# Altium project betrusted-kbd-interposer.PrjPcb
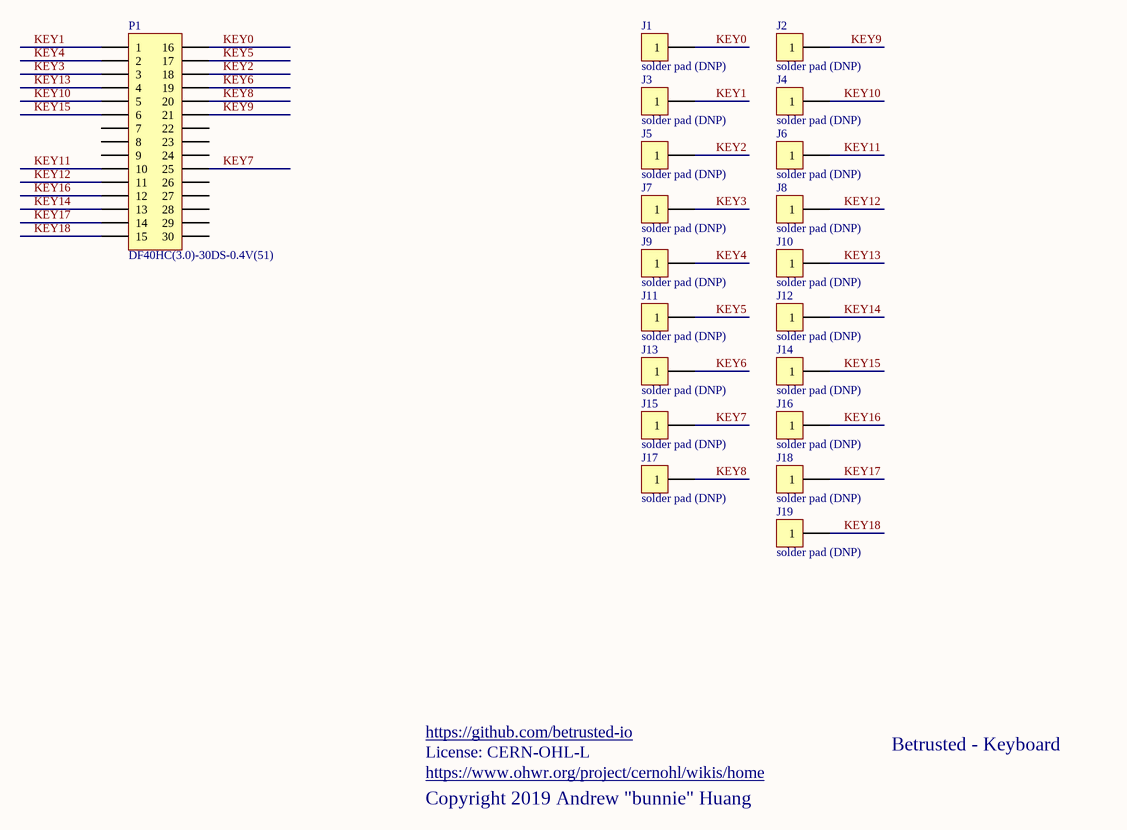
[diagram p0: interposer.SchDoc]
1 sheet, 20 parts. Net scope: global (net labels, ports and power ports of the same name join across sheets).
Board file: bt-kbd-interposer.PcbDoc

## Sheet interposer.SchDoc
size B

### Parts
J1  solder pad (DNP)  [TP_TH1.0mm_1.5x2mm_SQ]
J2  solder pad (DNP)  [TP_TH1.0mm_1.5x2mm_SQ]
J3  solder pad (DNP)  [TP_TH1.0mm_1.5x2mm_SQ]
J4  solder pad (DNP)  [TP_TH1.0mm_1.5x2mm_SQ]
J5  solder pad (DNP)  [TP_TH1.0mm_1.5x2mm_SQ]
J6  solder pad (DNP)  [TP_TH1.0mm_1.5x2mm_SQ]
J7  solder pad (DNP)  [TP_TH1.0mm_1.5x2mm_SQ]
J8  solder pad (DNP)  [TP_TH1.0mm_1.5x2mm_SQ]
J9  solder pad (DNP)  [TP_TH1.0mm_1.5x2mm_SQ]
J10  solder pad (DNP)  [TP_TH1.0mm_1.5x2mm_SQ]
J11  solder pad (DNP)  [TP_TH1.0mm_1.5x2mm_SQ]
J12  solder pad (DNP)  [TP_TH1.0mm_1.5x2mm_SQ]
J13  solder pad (DNP)  [TP_TH1.0mm_1.5x2mm_SQ]
J14  solder pad (DNP)  [TP_TH1.0mm_1.5x2mm_SQ]
J15  solder pad (DNP)  [TP_TH1.0mm_1.5x2mm_SQ]
J16  solder pad (DNP)  [TP_TH1.0mm_1.5x2mm_SQ]
J17  solder pad (DNP)  [TP_TH1.0mm_1.5x2mm_SQ]
J18  solder pad (DNP)  [TP_TH1.0mm_1.5x2mm_SQ]
J19  solder pad (DNP)  [TP_TH1.0mm_1.5x2mm_SQ]
P1  DF40HC(3.0)-30DS-0.4V(51)  [HRS_DF40HC(3.0)-30DS-0.4V(51)]

### Nets
KEY0: J1.1 P1.16
KEY1: J3.1 P1.1
KEY2: J5.1 P1.18
KEY3: J7.1 P1.3
KEY4: J9.1 P1.2
KEY5: J11.1 P1.17
KEY6: J13.1 P1.19
KEY7: J15.1 P1.25
KEY8: J17.1 P1.20
KEY9: J2.1 P1.21
KEY10: J4.1 P1.5
KEY11: J6.1 P1.10
KEY12: J8.1 P1.11
KEY13: J10.1 P1.4
KEY14: J12.1 P1.13
KEY15: J14.1 P1.6
KEY16: J16.1 P1.12
KEY17: J18.1 P1.14
KEY18: J19.1 P1.15

Not connected (* = marked no-connect by the designer): P1 7 8 9 22 23 24 26 27 28 29 30

### Notes on the sheet
- https://github.com/betrusted-io
- Betrusted - Keyboard
- Copyright 2019 Andrew "bunnie" Huang
- https://www.ohwr.org/project/cernohl/wikis/home
- License: CERN-OHL-L

### Library data of the parts
J1-J19 = CON1: Connector; MYPN: J-TP-PWRTAP-0603; MPN: DNP; VENDOR: DNP
P1 = Header 15X2A: Header, 15-Pin, Dual row; MYPN: J-DF40HC(3.0)-30DS-0.4V(51); VENDOR: Hirose; System: Connector; LatestRevisionDate: 17-Jul-2002; LatestRevisionNote: Re-released for DXP Platform.; Publisher: Altium Limited; MPN: DF40HC(3.0)-30DS-0.4V(51)